# EAGLE design WidgetArduinoProMiniBreakout (EAGLE 7.5.0)
DESIGNER: Ross; VERSION: 1.0
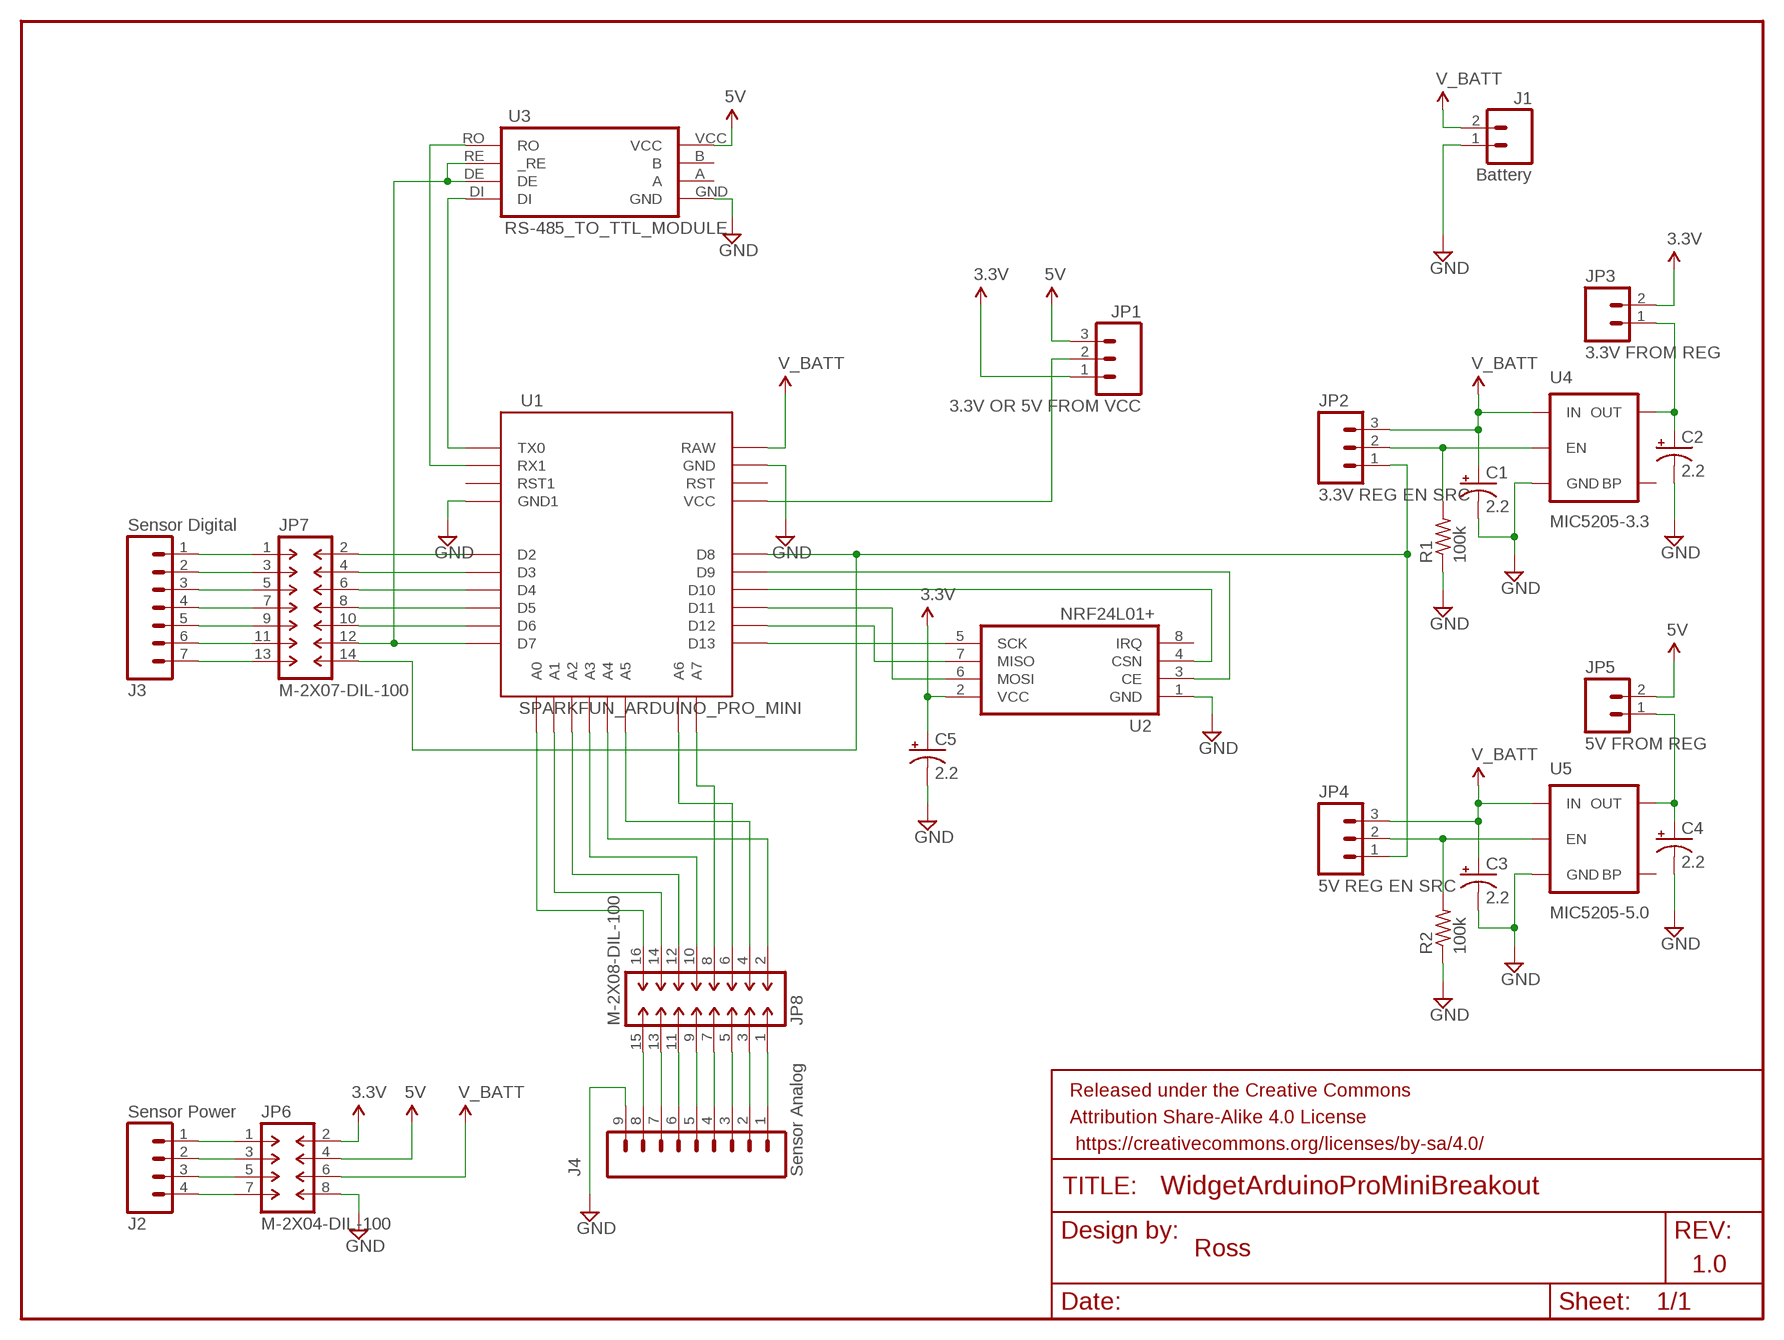
[diagram p0: schematic, sheet 1]

## Parts
C1  2.2  CPOL-USSMCA  [SMC_A]
C2  2.2  CPOL-USSMCA  [SMC_A]
C3  2.2  CPOL-USSMCA  [SMC_A]
C4  2.2  CPOL-USSMCA  [SMC_A]
C5  2.2  CPOL-USSMCA  [SMC_A]
FRAME1  FRAME-LETTER  [CREATIVE_COMMONS]
J1  Battery  JST-PH-2  [JST-PH-2-TH-VERT]
J2  Sensor Power  JST-PH-4  [JST-PH-4-TH-VERT]
J3  Sensor Digital  JST-PH-7  [JST-PH-7-TH-VERT]
J4  Sensor Analog  JST-PH-9  [JST-PH-9-TH-VERT]
JP1  3.3V OR 5V FROM VCC  M03LOCK_LONGPADS  [1X03_LOCK_LONGPADS]
JP2  3.3V REG EN SRC  M03LOCK_LONGPADS  [1X03_LOCK_LONGPADS]
JP3  3.3V FROM REG  M02LOCK_LONGPADS  [1X02_LOCK_LONGPADS]
JP4  5V REG EN SRC  M03LOCK_LONGPADS  [1X03_LOCK_LONGPADS]
JP5  5V FROM REG  M02LOCK_LONGPADS  [1X02_LOCK_LONGPADS]
JP6  M-2X04-DIL-100  [DIL-100-2X04]
JP7  M-2X07-DIL-100  [DIL-100-2X07]
JP8  M-2X08-DIL-100  [DIL-100-2X08]
R1  100k  R-US_R0603  [R0603]
R2  100k  R-US_R0603  [R0603]
U1  SPARKFUN_ARDUINO_PRO_MINI  [SPARKFUN_ARDUINO_PRO_MINI]
U2  NRF24L01+  NRF24L01P_MODULECHEAPCHEAP  [CHEAP_NRF24L01P_MODULE]
U3  RS-485_TO_TTL_MODULE  [RS-485_TO_TTL_MODULE]
U4  MIC5205-3.3  MIC52053.3V  [SOT23-5]
U5  MIC5205-5.0  MIC52055V  [SOT23-5]

## Nets
3.3V: C5.+ JP1.1 JP3.2 JP6.2 U2.2(VCC)
5V: JP1.3 JP5.2 JP6.4 U3.VCC
A0: JP8.16 U1.A0
A0_J4: J4.8 JP8.15
A1: JP8.14 U1.A1
A1_J4: J4.7 JP8.13
A2: JP8.12 U1.A2
A2_J4: J4.6 JP8.11
A3: JP8.10 U1.A3
A3_J4: J4.5 JP8.9
A4_J4: J4.2 JP8.3
A5_J4: J4.1 JP8.1
A6: JP8.6 U1.A6
A6_J4: J4.4 JP8.7
A7: JP8.8 U1.A7
A7_J4: J4.3 JP8.5
D2: JP7.2 U1.D2
D2_J3: J3.1 JP7.1
D3: JP7.4 U1.D3
D3_J3: J3.2 JP7.3
D4: JP7.6 U1.D4
D4_J3: J3.3 JP7.5
D5: JP7.8 U1.D5
D5_J3: J3.4 JP7.7
D6: JP7.10 U1.D6
D6_J3: J3.5 JP7.9
D7: JP7.12 U1.D7 U3.DE U3.RE(_RE)
D7_J3: J3.6 JP7.11
D8: JP2.1 JP4.1 JP7.14 U1.D8
D8_J3: J3.7 JP7.13
GND: C1.- C2.- C3.- C4.- C5.- J1.1 J4.9 JP6.8 R1.1 R2.1 U1.GND U1.GND1 U2.1(GND) U3.GND U4.2(GND) U5.2(GND)
N$1: JP1.2 U1.VCC
N$2: U1.D10 U2.4(CSN)
N$3: U1.TX0 U3.DI
N$4: U1.D13 U2.5(SCK)
N$5: U1.D12 U2.7(MISO)
N$6: U1.D11 U2.6(MOSI)
N$7: U1.D9 U2.3(CE)
N$8: JP8.4 U1.A5
N$9: JP2.2 R1.2 U4.3(EN)
N$10: C2.+ JP3.1 U4.5(OUT)
N$11: U1.RX1 U3.RO
N$12: C4.+ JP5.1 U5.5(OUT)
N$13: JP4.2 R2.2 U5.3(EN)
N$14: JP8.2 U1.A4
N$28: J2.1 JP6.1
N$29: J2.2 JP6.3
N$30: J2.3 JP6.5
N$31: J2.4 JP6.7
V_BATT: C1.+ C3.+ J1.2 JP2.3 JP4.3 JP6.6 U1.RAW U4.1(IN) U5.1(IN)
Unconnected: U1.RST U1.RST1 U2.8(IRQ) U3.A U3.B U4.4(BP) U5.4(BP)

## Library data of the parts
C1-C5 = rcl:CPOL-US: POLARIZED CAPACITOR, American symbol
FRAME1 = SparkFun-Aesthetics:FRAME-LETTER: Schematic Frame Standard 8.5x11 US Letter frame
J1 = skipzone:JST-PH-2: JST PH connector, 2 positions
J2 = skipzone:JST-PH-4: JST PH connector, 4 positions
J3 = skipzone:JST-PH-7: JST PH connector, 7 positions
J4 = skipzone:JST-PH-9: JST PH connector, 9 positions
JP1 JP2 JP4 = SparkFun-Connectors:M03: Header 3 Standard 3-pin 0.1" header. Use with straight break away headers (SKU : PRT-00116), right angle break away headers (PRT-00553), swiss pins (PRT-00743), machine pins (PRT-00117), and female headers (PRT-00115). Molex polarized connector foot print use with SKU : PRT-08232 with associated crimp pins and housings.
JP3 JP5 = SparkFun-Connectors:M02: Standard 2-pin 0.1" header. Use with - straight break away headers ( PRT-00116) - right angle break away headers (PRT-00553) - swiss pins (PRT-00743) - machine pins (PRT-00117) - female headers (PRT-00115) Molex polarized connector foot print use with: PRT-08233 with associated crimp pins and housings. 2.54_SCREWTERM for use with PRT-10571. 3.5mm Screw Terminal footprints for PRT-08084 5mm Screw Terminal footprints for use with PRT-08432
JP6 = con-headers-jp:M-2X04-: MALE HEADER
JP7 = con-headers-jp:M-2X07-: MALE HEADER
JP8 = con-headers-jp:M-2X08-: MALE HEADER
R1 R2 = rcl:R-US_: RESISTOR, American symbol
U1 = skipzone:SPARKFUN_ARDUINO_PRO_MINI: Sparkfun Arduino Pro Mini
U2 = skipzone:NRF24L01P_MODULE: NRF24L01+ module
U3 = skipzone:RS-485_TO_TTL_MODULE: RS-485 to TTL conversion module
U4 = SparkFun-PowerIC:MIC5205: MIC5205 150mA vreg 3.3V - VREG-00822 5V - VREG-00823; PROD_ID: VREG-00822
U5 = SparkFun-PowerIC:MIC5205: MIC5205 150mA vreg 3.3V - VREG-00822 5V - VREG-00823; PROD_ID: VREG-00823

## Board
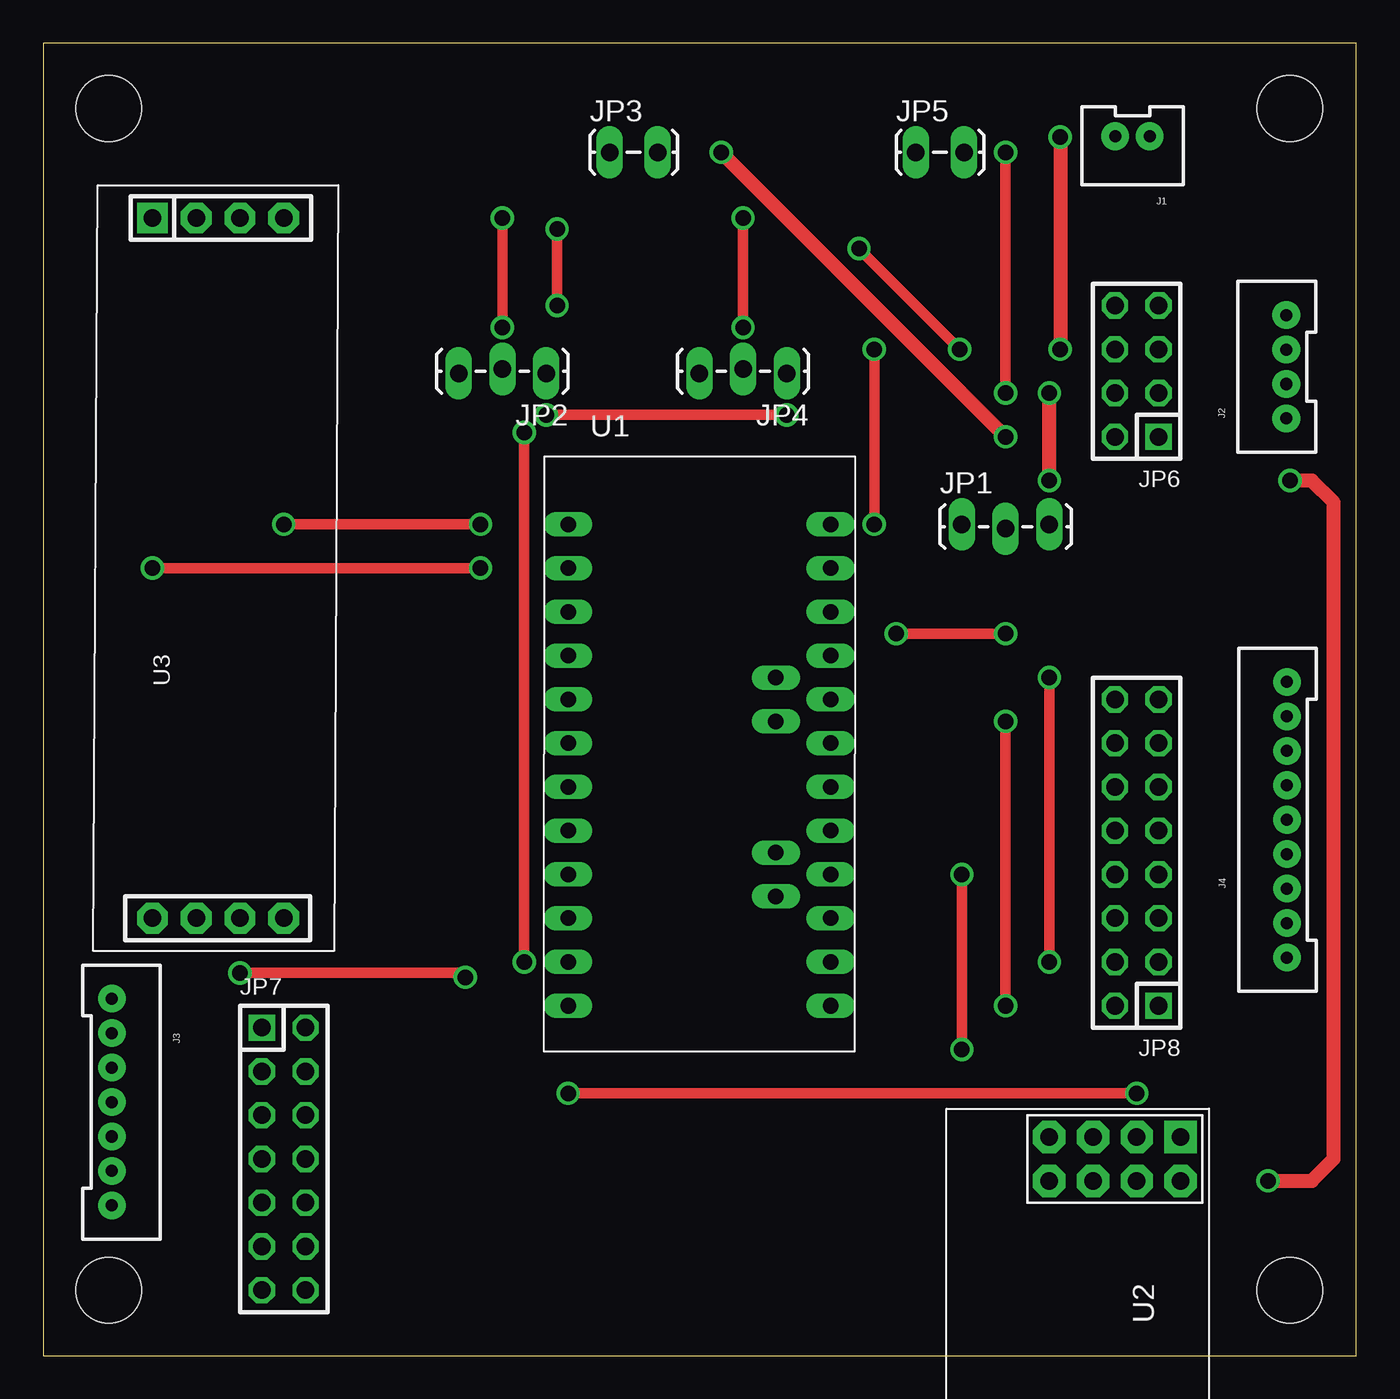
[diagram p1: board, top side]
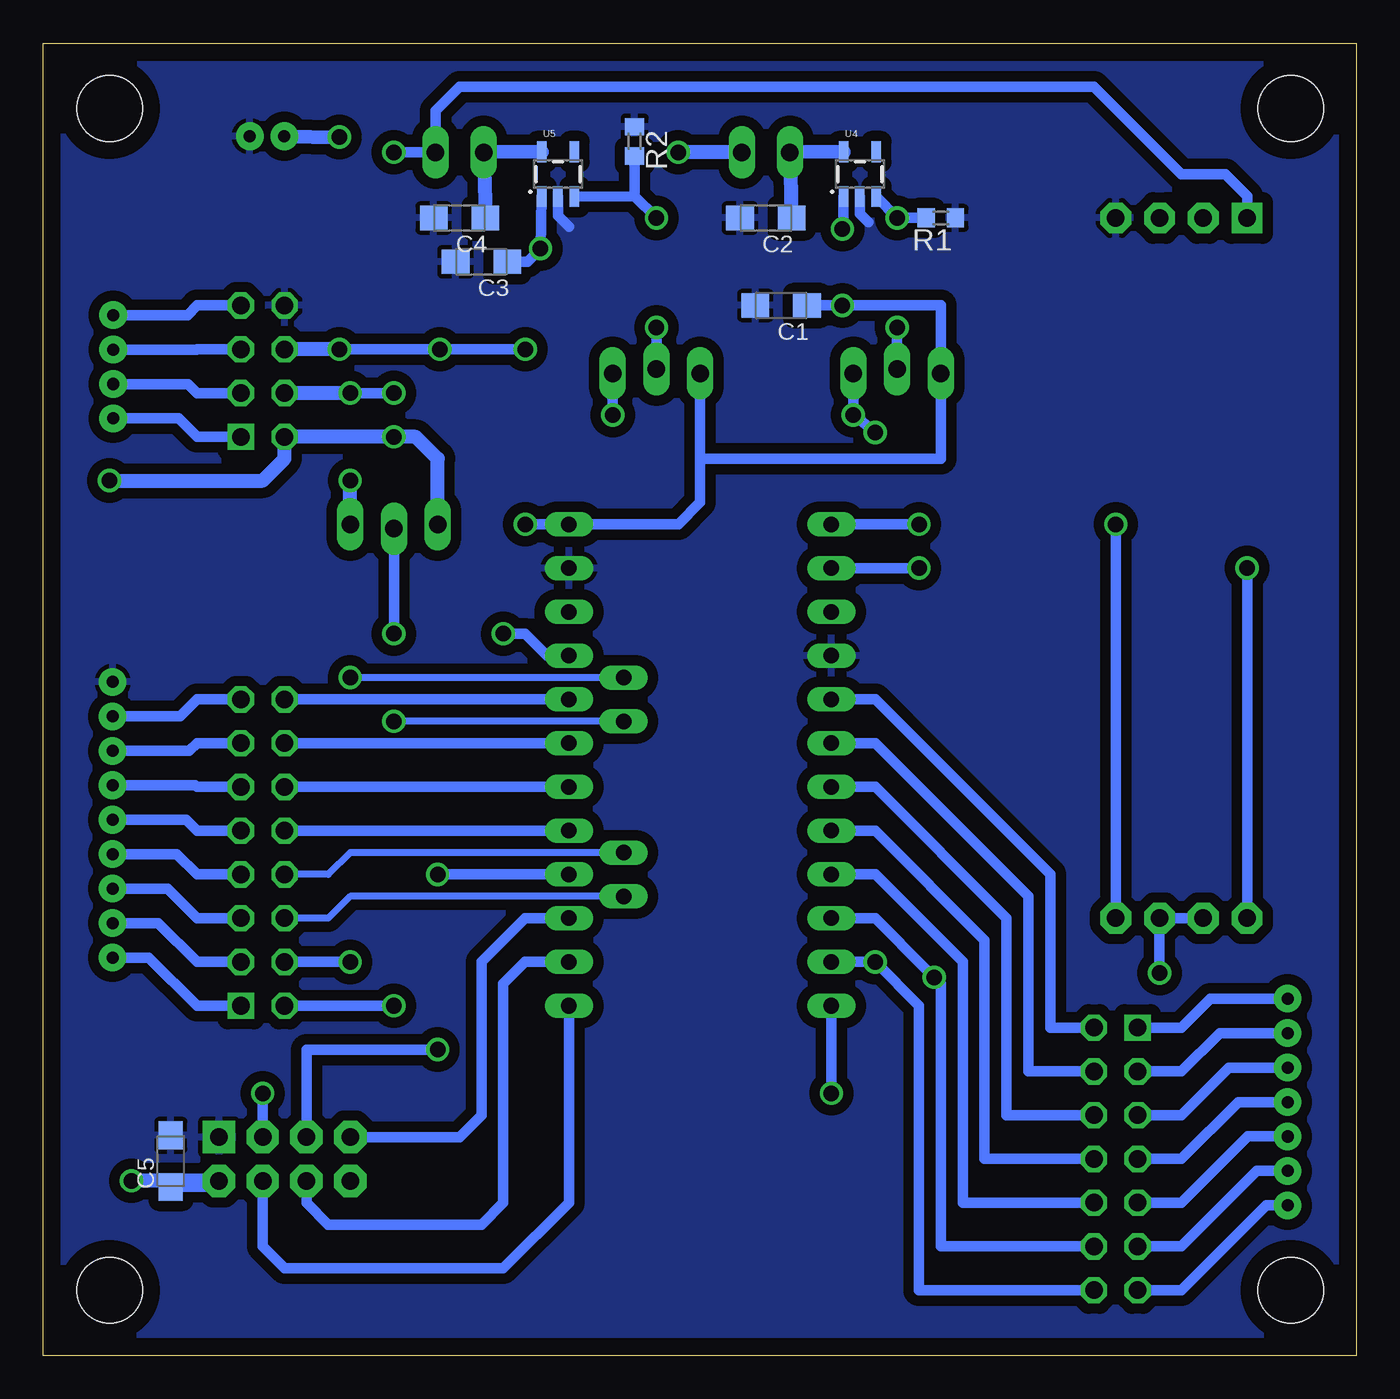
[diagram p2: board, bottom side, seen from below]

Size 76.25 x 76.19 mm. Coordinates in mm from the lower left corner, seen from the top.
Outline: 0,0 76.25,0 76.25,76.19 0,76.19 0,0
Copper layers (1*16): Top 0.035mm / dielectric 1.5mm / Bottom 0.035mm
Design rules "default": minimum track width 10mil, minimum drill 24mil, track to track 8mil, track to pad 8mil, pad to pad 8mil, via to via 8mil, smd to smd 8mil, copper to edge 40mil, drill to drill 8mil, minimum pad ring 10mil, minimum via ring 8mil, stop-mask expansion 4mil, vias tented up to drill 0mil, thermal gap 10mil
Holes 3.8 mm at 3.81,72.39 72.39,72.39 72.39,3.81 3.81,3.81

### Footprints (pad centres in the part's own frame; a part is rotated, then mirrored left to right if it is on the bottom)
SMC_A = smd 1.6 x 1.4: + -1.5,0; - 1.5,0
JST-PH-2-TH-VERT = drill 0.7 pad 1.6: 1 -1,-1.82; 2 1,-1.82
JST-PH-4-TH-VERT = drill 0.7 pad 1.6: 1 -3,-1.82; 2 -1,-1.82; 3 1,-1.82; 4 3,-1.82
JST-PH-7-TH-VERT = drill 0.7 pad 1.6: 1 -6,-1.09; 2 -4,-1.09; 3 -2,-1.09; 4 0,-1.09; 5 2,-1.09; 6 4,-1.09; 7 6,-1.09
JST-PH-9-TH-VERT = drill 0.7 pad 1.6: 1 -8,-1.09; 2 -6,-1.09; 3 -4,-1.09; 4 -2,-1.09; 5 0,-1.09; 6 2,-1.09; 7 4,-1.09; 8 6,-1.09; 9 8,-1.09
1X03_LOCK_LONGPADS = drill 1.016 long: 1 0,0; 2 2.54,-0.254; 3 5.08,0
1X02_LOCK_LONGPADS = drill 1.016 long: 1 -0.127,0; 2 2.667,0
DIL-100-2X04 = drill 1.016 square: 1 -3.81,-1.27 | drill 1.016 octagon: 2 -3.81,1.27; 3 -1.27,-1.27; 4 -1.27,1.27; 5 1.27,-1.27; 6 1.27,1.27; 7 3.81,-1.27; 8 3.81,1.27
DIL-100-2X07 = drill 1.016 square: 1 -7.62,-1.27 | drill 1.016 octagon: 2 -7.62,1.27; 3 -5.08,-1.27; 4 -5.08,1.27; 5 -2.54,-1.27; 6 -2.54,1.27; 7 0,-1.27; 8 0,1.27; 9 2.54,-1.27; 10 2.54,1.27; 11 5.08,-1.27; 12 5.08,1.27; 13 7.62,-1.27; 14 7.62,1.27
DIL-100-2X08 = drill 1.016 square: 1 -8.89,-1.27 | drill 1.016 octagon: 2 -8.89,1.27; 3 -6.35,-1.27; 4 -6.35,1.27; 5 -3.81,-1.27; 6 -3.81,1.27; 7 -1.27,-1.27; 8 -1.27,1.27; 9 1.27,-1.27; 10 1.27,1.27; 11 3.81,-1.27; 12 3.81,1.27; 13 6.35,-1.27; 14 6.35,1.27; 15 8.89,-1.27; 16 8.89,1.27
R0603 = smd 1 x 1.1: 1 -0.85,0; 2 0.85,0
SPARKFUN_ARDUINO_PRO_MINI = drill 0.9 long: A0 7.62,2.54; A1 7.62,0; A2 7.62,-2.54; A3 7.62,-5.08; A4 4.445,1.27; A5 4.445,3.81; A6 4.445,-8.89; A7 4.445,-6.35; D2 -7.62,2.54; D3 -7.62,0; D4 -7.62,-2.54; D5 -7.62,-5.08; D6 -7.62,-7.62; D7 -7.62,-10.16; D8 -7.62,-12.7; D9 -7.62,-15.24; D10 7.62,-15.24; D11 7.62,-12.7; D12 7.62,-10.16; D13 7.62,-7.62; GND 7.62,10.16; GND1 -7.62,5.08; RAW 7.62,12.7; RST 7.62,7.62; RST1 -7.62,7.62; RX1 -7.62,10.16; TX0 -7.62,12.7; VCC 7.62,5.08
CHEAP_NRF24L01P_MODULE = drill 1.016 pad 1.88 square: 1 -13.589,5.969 | drill 1.016 pad 1.88 octagon: 2 -11.049,5.969; 3 -13.589,3.429; 4 -11.049,3.429; 5 -13.589,0.889; 6 -11.049,0.889; 7 -13.589,-1.651; 8 -11.049,-1.651
RS-485_TO_TTL_MODULE = drill 1.016 pad 1.778 octagon: A 20.574,-0.635; B 20.574,1.905; DE -20.066,-0.635; DI -20.066,-3.175; GND 20.574,-3.175; RE -20.066,1.905; RO -20.066,4.445 | drill 1.016 pad 1.778 square: VCC 20.574,4.445
SOT23-5 = smd 0.55 x 1.2: 1 -0.95,-1.3; 2 0,-1.3; 3 0.95,-1.3; 4 0.95,1.3; 5 -0.95,1.3

### Placement (x,y rotation side)
C1  33.4,60.96 180 bottom
C2  34.29,66.04 180 bottom
C3  50.8,63.5 180 bottom
C4  52.07,66.04 180 bottom
C5  68.83,11.3 90 bottom
FRAME1  15.24,-10.16 0 top  (outside the outline)
J1  63.25,68.96 180 top
J2  70.36,57.4 90 top
J3  5.08,14.73 270 top
J4  71.12,31.11 90 top
JP1  53.34,48.26 0 top
JP2  29.21,57.02 180 top
JP3  33.02,69.85 0 top
JP4  43.18,57.02 180 top
JP5  50.8,69.85 0 top
JP6  63.5,57.15 90 top
JP7  13.97,11.43 270 top
JP8  63.5,29.21 90 top
R1  24.13,66.04 180 bottom
R2  41.91,70.48 270 bottom
U1  38.1,35.56 0 top
U2  60.07,-0.89 270 top
U3  10.79,45.47 90 top
U4  28.83,68.58 0 bottom
U5  46.35,68.58 0 bottom

### Tracks (layer width: path | path; a pad name or v marks a point on that pad's centre or on a via)
3.3V  (via drill 0.9)
  Top 0.813: v39.37,69.85 v55.88,53.34 | v71.12,10.16 73.66,10.16 74.93,11.43 74.93,49.53 73.66,50.8 v72.39,50.8
  Bottom 0.61: U2.2 66.4,9.8 C5.+
  Bottom 0.813: JP3.2 v39.37,69.85 | JP1.1 53.34,52.07 54.61,53.34 v55.88,53.34 JP6.2 62.23,52.07 63.5,50.8 v72.39,50.8 | U2.2 v71.12,10.16
5V  (via drill 0.9)
  Top 0.61: v55.88,69.85 v55.88,55.88
  Top 0.813: v58.42,50.8 v58.42,55.88
  Bottom 0.61: v55.88,69.85 JP5.2 53.47,72.26 52.07,73.66 15.24,73.66 10.16,68.58 7.62,68.58 6.35,67.31 U3.VCC | v55.88,55.88 v58.42,55.88
  Bottom 0.813: JP1.3 v58.42,50.8 | v58.42,55.88 JP6.4
A0
  Bottom 0.61: U1.A0 JP8.16
A0_J4
  Bottom 0.61: JP8.15 67.31,38.1 68.3,37.12 J4.8
A1
  Bottom 0.61: U1.A1 JP8.14
A1_J4
  Bottom 0.61: JP8.13 67.31,35.56 67.75,35.12 J4.7
A2
  Bottom 0.61: U1.A2 JP8.12
A2_J4
  Bottom 0.61: JP8.11 67.31,33.02 67.41,33.12 J4.6
A3
  Bottom 0.61: U1.A3 JP8.10
A3_J4
  Bottom 0.61: JP8.9 67.31,30.48 67.94,31.11 J4.5
A4_J4
  Bottom 0.61: JP8.3 67.31,22.86 69.56,25.11 J4.2
A5_J4
  Bottom 0.61: JP8.1 67.31,20.32 70.11,23.11 J4.1
A6
  Bottom 0.406: U1.A6 58.42,26.67 59.69,25.4 JP8.6
A6_J4
  Bottom 0.61: JP8.7 67.31,27.94 68.48,29.11 J4.4
A7
  Bottom 0.406: U1.A7 58.42,29.21 59.69,27.94 JP8.8
A7_J4
  Bottom 0.61: JP8.5 67.31,25.4 69.03,27.11 J4.3
D2
  Bottom 0.61: JP7.2 17.78,19.05 17.78,27.94 27.94,38.1 U1.D2
D2_J3
  Bottom 0.61: JP7.1 10.16,19.05 8.48,20.73 J3.1
D3
  Bottom 0.61: JP7.4 19.05,16.51 19.05,26.67 27.94,35.56 U1.D3
D3_J3
  Bottom 0.61: JP7.3 10.16,16.51 7.94,18.73 J3.2
D4
  Bottom 0.61: JP7.6 20.32,13.97 20.32,25.4 27.94,33.02 U1.D4
D4_J3
  Bottom 0.61: JP7.5 10.16,13.97 7.4,16.73 J3.3
D5
  Bottom 0.61: JP7.8 21.59,11.43 21.59,24.13 27.94,30.48 U1.D5
D5_J3
  Bottom 0.61: JP7.7 10.16,11.43 6.86,14.73 J3.4
D6
  Bottom 0.61: JP7.10 22.86,8.89 22.86,22.86 27.94,27.94 U1.D6
D6_J3
  Bottom 0.61: JP7.9 10.16,8.89 6.32,12.73 J3.5
D7  (via drill 0.9)
  Top 0.61: v11.43,22.23 24.26,22.23 v24.51,21.97
  Bottom 0.61: U3.RE U3.DE v11.43,22.23 | U1.D7 27.94,25.4 24.96,22.42 v24.51,21.97 24.13,21.59 24.13,6.35 JP7.12
D7_J3
  Bottom 0.61: JP7.11 10.16,6.35 5.78,10.73 J3.6
D8  (via drill 0.9)
  Top 0.61: v43.18,54.61 v29.21,54.61 | v27.94,53.59 v27.94,22.86
  Bottom 0.61: JP7.14 25.4,3.81 25.4,20.32 v27.94,22.86 U1.D8 | JP4.1 v43.18,54.61 | JP2.1 v29.21,54.61 v27.94,53.59
D8_J3
  Bottom 0.61: JP7.13 10.16,3.81 5.24,8.73 J3.7
GND
  Bottom 0.61: U4.2 28.83,66.29 28.32,65.79 | U5.2 46.35,66.17 45.72,65.53
  pour Bottom (isolate 0.61): -1.27,77.47 77.47,77.47 77.47,-1.27 -1.27,-1.27
N$1  (via drill 0.9)
  Top 0.61: v49.53,41.91 v55.88,41.91
  Bottom 0.61: U1.VCC 46.99,40.64 48.26,41.91 v49.53,41.91 | v55.88,41.91 JP1.2
N$2
  Bottom 0.61: U1.D10 45.72,8.89 49.53,5.08 62.23,5.08 63.5,6.35 U2.4
N$3  (via drill 0.9)
  Top 0.61: v13.97,48.26 v25.4,48.26
  Bottom 0.61: U3.DI v13.97,48.26 | v25.4,48.26 U1.TX0
N$4  (via drill 0.9)
  Top 0.61: v53.34,27.94 v53.34,17.78
  Bottom 0.61: U1.D13 v53.34,27.94 | v53.34,17.78 60.96,17.78 U2.5
N$5
  Bottom 0.61: U1.D12 48.26,25.4 50.8,22.86 50.8,13.97 52.07,12.7 U2.7
N$6
  Bottom 0.61: U1.D11 48.26,22.86 49.53,21.59 49.53,8.89 50.8,7.62 59.69,7.62 60.96,8.89 U2.6
N$7  (via drill 0.9)
  Top 0.61: v63.5,15.24 v30.48,15.24
  Bottom 0.61: U2.3 v63.5,15.24 | v30.48,15.24 U1.D9
N$8  (via drill 0.9)
  Top 0.61: v58.42,39.37 v58.42,22.86
  Bottom 0.406: U1.A5 v58.42,39.37
  Bottom 0.61: v58.42,22.86 JP8.4
N$9  (via drill 0.9)
  Top 0.61: v26.67,59.69 v26.67,66.04
  Bottom 0.61: JP2.2 v26.67,59.69 | U4.3 v26.67,66.04 R1.2
N$10
  Bottom 0.813: U4.5 JP3.1 C2.+
N$11  (via drill 0.9)
  Top 0.61: v6.35,45.72 v25.4,45.72
  Bottom 0.61: U3.RO v6.35,45.72 | v25.4,45.72 U1.RX1
N$12
  Bottom 0.813: U5.5 JP5.1 C4.+
N$13  (via drill 0.9)
  Top 0.61: v40.64,59.69 v40.64,66.04
  Bottom 0.61: JP4.2 v40.64,59.69 | v40.64,66.04 41.91,67.31 | 41.91,67.31 U5.3 | R2.2 41.91,67.31
N$14  (via drill 0.9)
  Top 0.61: v55.88,36.83 v55.88,20.32
  Bottom 0.406: U1.A4 v55.88,36.83
  Bottom 0.61: v55.88,20.32 JP8.2
N$28
  Bottom 0.61: JP6.1 67.31,53.34 68.37,54.4 J2.1
N$29
  Bottom 0.61: JP6.3 67.31,55.88 67.83,56.4 J2.2
N$30
  Bottom 0.61: JP6.5 67.31,58.42 67.33,58.4 J2.3
N$31
  Bottom 0.61: JP6.7 67.31,60.96 67.87,60.4 J2.4
V_BATT  (via drill 0.9)
  Top 0.61: v29.84,65.41 v29.84,60.96 | v48.26,58.42 v48.26,48.26 | v47.37,64.26 v53.21,58.42
  Top 0.813: v59.05,70.74 v59.05,58.42
  Bottom 0.61: 38.1,52.07 38.1,49.53 39.37,48.26 U1.RAW v48.26,48.26 | 38.1,52.07 JP4.3 | 38.1,52.07 24.13,52.07 JP2.3 24.13,60.96 v29.84,60.96 C1.+ | U4.1 29.78,65.47 v29.84,65.41 | U5.1 v47.37,64.26 48.13,63.5 C3.+ | v59.05,58.42 v53.21,58.42 v48.26,58.42
  Bottom 0.813: J1.2 v59.05,70.74 | v59.05,58.42 JP6.6